# Altium project HARDWARE TASK.PrjPcb
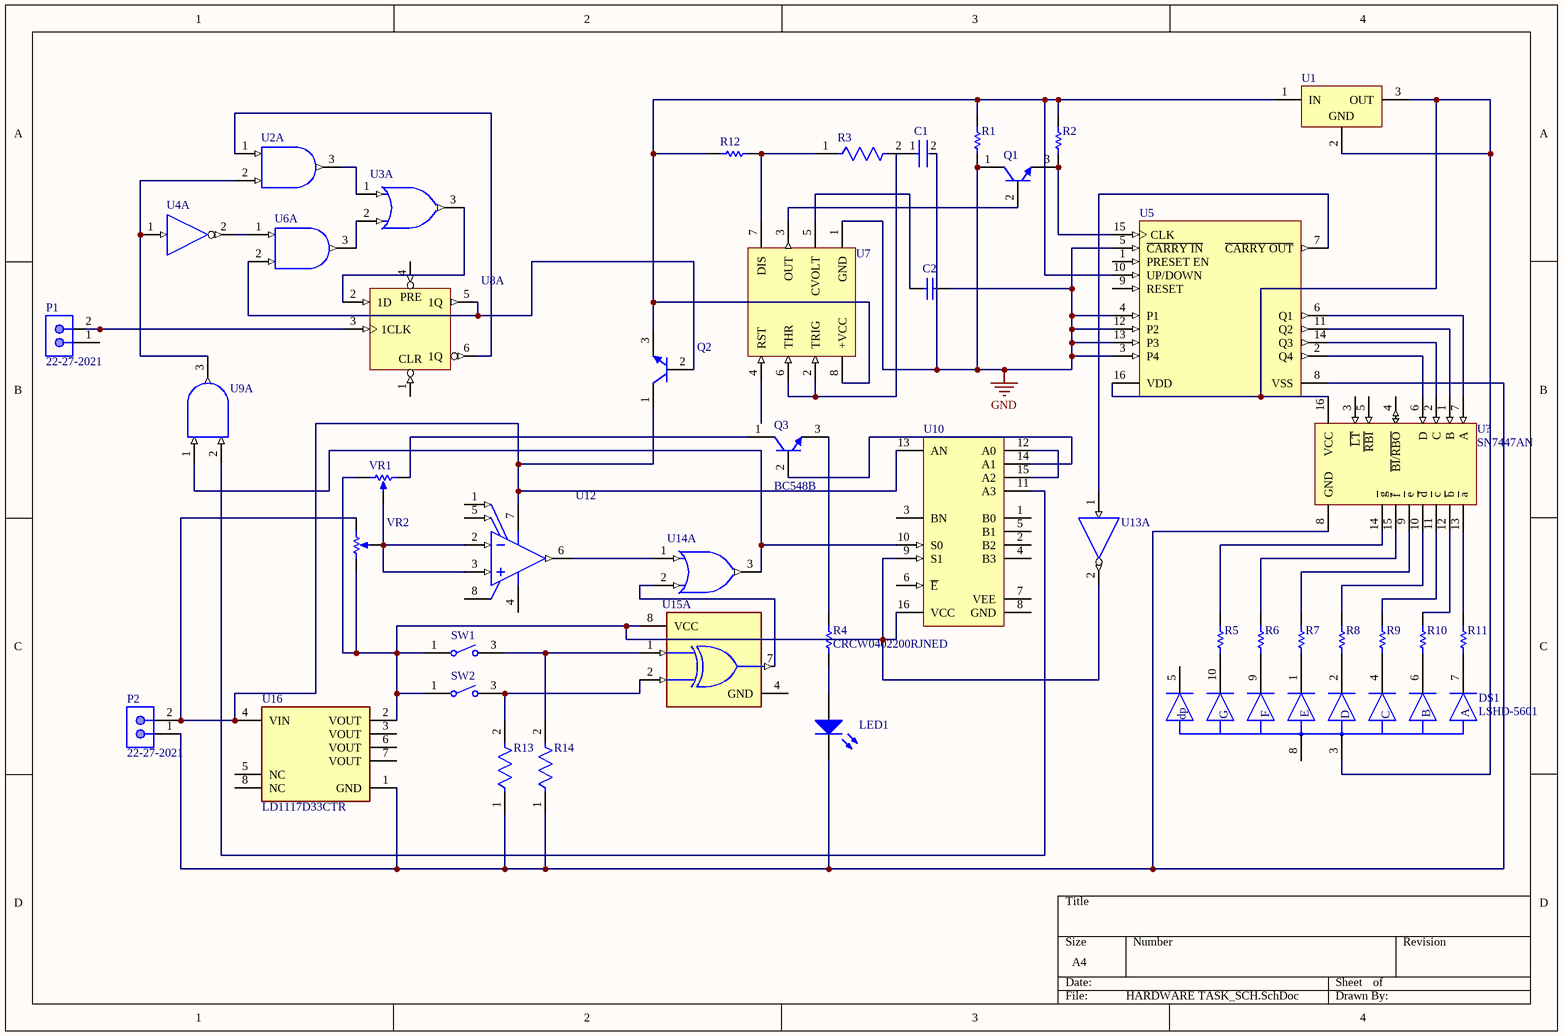
[diagram p0: HARDWARE TASK_SCH.SchDoc]
1 sheet, 43 parts. Net scope: global (net labels, ports and power ports of the same name join across sheets).
Board file: HARDWARE TASK_PCB.PcbDoc

## Sheet HARDWARE TASK_SCH.SchDoc
size A4; SheetNumber: 1; SheetTotal: 1

### Parts
C1  GRM21BR61E106KA73L  [CAP 10UF]  (value not drawn)
C2  GRM188R71H103KA01D  [CAP 10NF]  (value not drawn)
DS1  LSHD-5601  [7SEG]
LED1  151051BS04000  [BLUE LED]  (value not drawn)
P1  22-27-2021  [PIN]
P2  22-27-2021  [PIN]
Q1  BC548B  [NPN TRANS]  (value not drawn)
Q2  BC548B  [NPN TRANS]  (value not drawn)
Q3  BC548B  [NPN TRANS]
R1  CRCW0402200RJNED  [200 OHM RES]  (value not drawn)
R2  CRCW0402200RJNED  [200 OHM RES]  (value not drawn)
R3  RN732BTTD6002B25  [60KOHM RES]  (value not drawn)
R4  CRCW0402200RJNED  [200 OHM RES]
R5  CRCW0402200RJNED  [200 OHM RES]  (value not drawn)
R6  CRCW0402200RJNED  [200 OHM RES]  (value not drawn)
R7  CRCW0402200RJNED  [200 OHM RES]  (value not drawn)
R8  CRCW0402200RJNED  [200 OHM RES]  (value not drawn)
R9  CRCW0402200RJNED  [200 OHM RES]  (value not drawn)
R10  CRCW0402200RJNED  [200 OHM RES]  (value not drawn)
R11  CRCW0402200RJNED  [200 OHM RES]  (value not drawn)
R12  CRCW121010K0FKEAHP  [10KOHM RES]  (value not drawn)
R13  CRCW0603330RFKEA  [330OHM RES]  (value not drawn)
R14  CRCW0603330RFKEA  [330OHM RES]  (value not drawn)
SW1  TS02CBE  [SPST SWITCH]  (value not drawn)
SW2  TS02CBE  [SPST SWITCH]  (value not drawn)
U1  LM340T-5.0  [5V REG]  (value not drawn)
U2  SN74LS08DBR  [AND]  (value not drawn)  (part A of 5)
U3  SN74LS32NSR  [OR]  (value not drawn)  (part A of 5)
U4  SN74LS04DR  [INVERTER NOT]  (value not drawn)  (part A of 7)
U5  CD4510BNSR  [BCD COUNTER]  (value not drawn)
U6  SN74LS08DBR  [AND]  (value not drawn)  (part A of 5)
U7  LM555CMM/NOPB  [TIMER_1]  (value not drawn)
U8  SN74LS74AD  [D FLIP FLOP]  (value not drawn)  (part A of 3)
U9  SN74LS08DBR  [AND]  (value not drawn)  (part A of 5)
U10  CD74HC4052E  [DEMUX]  (value not drawn)
U12  UA741CD  [OP AMP]  (value not drawn)
U13  SN74LS04DR  [INVERTER NOT]  (value not drawn)  (part A of 7)
U14  SN74LS32NSR  [OR]  (value not drawn)  (part A of 5)
U15  SN74LVC2G86DCTR  [XOR - duplicate]  (value not drawn)  (part A of 2)
U16  LD1117D33CTR  [3.3V REG]
U?  SN7447AN  [7SEG DECODER]
VR1  3852A-282-103AL  [POT]  (value not drawn)
VR2  3852A-282-103AL  [POT]  (value not drawn)

### Nets
GND: C1.2 C2.2 Q1.1(C) R1.1 U5.3(P4) U5.4(P1) U5.5(~{CARRY_IN}) U5.12(P2) U5.13(P3) U7.1(GND)
NetC1_1: C1.1 R3.2
NetC2_1: C2.1 U7.5(CVOLT)
NetDS1_1: DS1.1(CATHODE_E) R7.1
NetDS1_2: DS1.2(CATHODE_D) R8.1
NetDS1_3: DS1.3(COMMON_ANODE) U1.2(GND) U1.3(OUT) U5.16(VDD) U?.16(VCC)
NetDS1_4: DS1.4(CATHODE_C) R9.1
NetDS1_6: DS1.6(CATHODE_B) R10.1
NetDS1_7: DS1.7(CATHODE_A) R11.1
NetDS1_9: DS1.9(CATHODE_F) R6.1
NetDS1_10: DS1.10(CATHODE_G) R5.1
NetLED1_1: LED1.1(K) P2.1 R13.1 R14.1 U5.8(VSS) U16.1(GND) U?.8(GND)
NetLED1_2: LED1.2(A) R4.1
NetP1_2: P1.2 U8.3(1CLK)
NetP2_2: P2.2 Q2.1(C) U10.13(AN) U12.7(VCC+) U16.4(VIN) VR2.3(CW)
NetQ1_2: Q1.2(B) U7.3(OUT)
NetQ1_3: Q1.3(E) R2.1 U5.15(CLK)
NetQ2_2: Q2.2(B) U6.2(1B) U8.5(1Q)
NetQ2_3: Q2.3(E) R1.2 R2.2 R12.1 U1.1(IN) U5.10(UP/DOWN) U7.8(+VCC)
NetQ3_1: Q3.1(C) VR1.3(CW)
NetQ3_2: Q3.2(B) U10.14(A1)
NetQ3_3: Q3.3(E) R4.2
NetR3_1: R3.1 R12.2 U7.7(DIS)
NetR5_2: R5.2 U?.14(~{g})
NetR6_2: R6.2 U?.15(~{f})
NetR7_2: R7.2 U?.9(~{e})
NetR8_2: R8.2 U?.10(~{d})
NetR9_2: R9.2 U?.11(~{c})
NetR10_2: R10.2 U?.12(~{b})
NetR11_2: R11.2 U?.13(~{a})
NetR13_2: R13.2 SW2.3 U15.2(1B)
NetR14_2: R14.2 SW1.3 U15.1(1A)
NetSW1_1: SW1.1 SW2.1 U10.9(S1) U10.16(VCC) U13.2(~{1Y}) U15.8(VCC) U16.2(VOUT) VR1.1(CCW) VR2.1(CCW)
NetU2_1: U2.1(1A) U8.6(1Q)
NetU2_2: U2.2(1B) U4.1(1A) U9.3(1Y)
NetU2_3: U2.3(1Y) U3.1(1A)
NetU3_2: U3.2(1B) U6.3(1Y)
NetU3_3: U3.3(1Y) U8.2(1D)
NetU4_2: U4.2(~{1Y}) U6.1(1A)
NetU5_2: U5.2(Q4) U?.6(D)
NetU5_6: U5.6(Q1) U?.7(A)
NetU5_7: U5.7(~{CARRY_OUT}) U13.1(1A)
NetU5_11: U5.11(Q2) U?.1(B)
NetU5_14: U5.14(Q3) U?.2(C)
NetU7_2: U7.2(TRIG) U7.6(THR)
NetU9_1: U9.1(1A) U10.10(S0) U14.3(1Y)
NetU9_2: U9.2(1B) U10.11(A3)
NetU10_12: U10.12(A0) U10.15(A2)
NetU12_2: U12.2(IN-) U12.3(IN+) VR1.2(S) VR2.2(S)
NetU12_6: U12.6(OUT) U14.1(1A)
NetU14_2: U14.2(1B) U15.7(1Y)

Not connected (* = marked no-connect by the designer): DS1 5(CATHODE_DP) 8(COMMON_ANODE); P1 1; U5 1(PRESET_EN) 9(RESET); U7 4(RST); U8 1(1~{CLR}) 4(1~{PRE}); U10 1(B0) 2(B2) 3(BN) 4(B3) 5(B1) 6(~{E}) 7(VEE) 8(GND); U12 1(OFFSET_N1) 4(VCC-) 5(OFFSET_N2) 8(NC); U15 4(GND); U16 3(VOUT) 5(NC) 6(VOUT) 7(VOUT) 8(NC); U? 3(~{LT}) 4(~{BI}/~{RBO}) 5(~{RBI})

### Notes on the sheet
- (in symbol 7SEG) dp; G; F; E; D; C; B; A
- (in symbol D FLIP FLOP, part A) PRE; CLR

### Library data of the parts
C1 = CAP 10UF: Chip Multilayer Ceramic Capacitors for General Purpose, 0805, 10uF, X5R, 15%, 10%, 25V; Length: 2mm; Depth: 1.25mm; Termination: SMD/SMT; Voltage: 25V; Height: 1.25mm; Material: Ceramic; Thickness: 0.053inch; Radiation Hardening: No; Min Operating Temperature: -55°C; Width: 0.049inch; Package Quantity: 1; Mount: Surface Mount; Dielectric: X5R; Packaging: Tape and Reel; Capacitance: 10uF; Voltage Rating (DC): 25V; Lead Free: Lead Free; Max Operating Temperature: 85°C; Case Code (Imperial): 0805; Case/Package: 0805; Tolerance: 10%; Voltage Rating: 25V; Case Code (Metric): 2012
C2 = CAP 10NF: Chip Capacitor, 10 nF, +/- 10%, 50 V, -55 to 125 degC, 0603 (1608 Metric), RoHS, Tape and Reel; Manufacturer: Murata; Insulation Resistance: 10GR; Dielectric: X7R; Voltage Rating: 50V; Capacitance: 10nF; Material: Ceramic; Package Quantity: 1; Lead Free: LeadFree; Case/Package: 0603; Termination: SMD/SMT; REACH SVHC: Unknown; Manufacturer URL: http://www.murata.com/; Datasheet URL: http://search.murata.co.jp/Ceramy/image/img/A01X/G101/ENG/GRM188R71H103KA01-01.pdf; Mount: SurfaceMount; Datasheet Version: 42401.0; Number of Pins: 2; Length: 1.6mm; Voltage: 50V; Depth: 0.8mm; Tolerance: 10%; Min Operating Temperature: -55degC; Voltage Rating (DC): 50V; Max Operating Temperature: 125degC; Package Description: 2-Pin Surface Mount Device, Body 1.6 x 0.8 mm; RoHSCompliant: True; Case Code (Imperial): 0603; Width: 0.031inch; Case Code (Metric): 1608; Height: 0.8mm; Package Reference: 0603; Packaging: TapeandReel; Thickness: 0.035inch; Dielectric Material: Ceramic
DS1 = 7SEG: LED 7-SEG .56" GREEN 565NM CA; Manufacturer: Lite-On; Wavelength: 569nm; Luminous Intensity: 2.4mcd; Forward Current: 20mA; Forward Voltage: 2.1V; Element Config: Common Anode; Reverse Voltage: 5V; Device Class L1: Optoelectronics; ComponentLink2URL: https://media.digikey.com/pdf/Data%20Sheets/Lite-On%20PDFs/LSHD-5601.pdf; Temperature Range High: +105°C; ComponentLink2Description: Datasheet; Automotive: No; Temperature: -35°C to +105°C; Mouser Description: LED Displays & Accessories Green, Low Current 0.56, CARHD; Package: LSHD-5601; Device Class L3: LED Displays; Height: 8.25mm; Digikey Description: LED 7-SEG .56" GREEN 565NM CA; Category: Disp; Display Type: LED; Octopart: https://octopart.com/lshd-5601-lite-on-548440; Lead Free: Yes; Temperature Range Low: -35°C; RoHS: TRUE; Test Current: 20mA; Manufacturer Part Number: LSHD-5601; Device Class L2: Displays
LED1 = BLUE LED: THT LED round mono-color color lens, WL-TMRW, Blue; Manufacturer: Wuerth Elektronik; PackageReference: Type 5mm; ComponentLink2Description: Datasheet; ComponentLink1Description: Manufacturer URL; Emitting color: Blue; ComponentLink1URL: http://www.we-online.com; PartNumber: 151051BS04000; ComponentLink2URL: http://katalog.we-online.de/pbs/datasheet/7448042001.pdfhttp://katalog.we-online.de/pbs/datasheet/7448042001.pdfhttp://katalog.we-online.de/pbs/datasheet/7448042001.pdfhttp://katalog.we-online.de/pbs/datasheet/151051BS04000.pdf
P1 P2 = PIN: Male Header, Pitch 2.54 mm, 1 x 2 Position, Height 11.7 mm, Tail Length 3.56 mm, 0 to 75 degC, RoHS, Bulk; Manufacturer: Molex; PartNumber: 0022272021; Current rating: 4A; Package Version: Rev. BC, 02/2012; Voltage rating: 250V; No. of Positions: 2; Pitch: 2.54mm; No. of Rows: 1; Orientation: Vertical; Operating temperature: 0°Cto+75°C; Manufacturer URL: http://www.molex.com/; Mounting Technology: ThroughHole; Housing material: Nylon(UL94V-0); Package Description: 2-Leads Header, Body 5.08 x 5.8 mm, Pitch 2.54 mm; Voltage - Max: 250V; Datasheet URL: http://www.molex.com/pdm_docs/sd/022272021_sd.pdf; Package Reference: 22-27-2021; Contact material: Tinplatedbrass; Current - Max: 4A; Datasheet Version: Rev. F, 06/2009
Q1-Q3 = NPN TRANSISTOR: Amplifier Transistor, NPN Silicon, 3-Pin TO-92, Bulk Box; Manufacturer: On Semiconductor; IC Continuous (A): 0.1; fT Min (MHz): 150; Mounting Technology: Through Hole; ComponentLink3Description: Package Specification; Polarity: NPN; ComponentLink3URL: http://www.onsemi.cn/pub_link/Collateral/2N6426-D.PDF; PartNumber: BC548B; ComponentLink2Description: Datasheet; ComponentLink1Description: Manufacturer URL; ComponentLink2URL: http://www.onsemi.com/pub_link/Collateral/BC546-D.PDF; PackageReference: TO-92-3-29-11_AM_SL; DatasheetVersion: Rev. 7; PackageDescription: 3-Pin Transistor Outline, Body 4.825 x 3.685 mm, Pitch 1.27 mm; PackageVersion: Rev. AM; Packing: Bulk Box; RoHS: FALSE; ComponentLink1URL: http://www.onsemi.com/
R1 R2 R4-R11 = 200OHM RES: Manufacturer: Vishay Dale; Part Number: CRCW0402200RJNED
R3 = 60KOHM RES: 60kΩ ±0.1% 0.125W, 1/8W Chip Resistor 1206 (3216 Metric) Moisture Resistant Thin Film; Resistance: 60kR; Voltage Rating: 150V; Power Rating: 125mW; Temperature Coefficient: 25ppm/°C; Length: 3.2mm; Min Operating Temperature: -55°C; Width: 1.6mm; Termination: SMD/SMT; Weight: 0.000571oz; Max Operating Temperature: 125°C; Tolerance: 0.1%; Composition: Thin Film; Height: 0.6mm; Packaging: Tape and Reel; Case Code (Metric): 3216; Case Code (Imperial): 1206; Case/Package: 1206
R12 = 10KOHM RES: Manufacturer: Vishay Dale; Part Number: CRCW121010K0FKEAHP
R13 R14 = 33OHM RES: RES Thick Film, 330Ω, 1%, 0.1W, 100ppm/°C, 0603; Voltage Rating: 75V; Max Power Dissipation: 100mW; Resistance: 330R; Depth: 0.85mm; Contact Plating: Tin; Package Quantity: 10; Termination: SMD/SMT; Tolerance: 1%; Height: 0.45mm; Number of Terminations: 2; Radiation Hardening: No; Features: Automotive AEC-Q200; Case/Package: 0603; Mount: Surface Mount; Case Code (Metric): 1608; Lead Free: Lead Free; Temperature Coefficient: 100ppm/°C; Weight: 7.1E-05oz; Military Standard: Not; Packaging: Tape and Reel; Max Operating Temperature: 155°C; Voltage Rating (DC): 75V; Length: 1.55mm; Min Operating Temperature: -55°C; Composition: Thick Film; Case Code (Imperial): 0603; Width: 0.033inch; Power Rating: 100mW
SW1 SW2 = SPST SWITCH: Tiny Slide Switch, SPST, 20 V, -30 to 85 degC, 2-Pin THD, RoHS, Bulk; Manufacturer: C&K Components; Product Height (mm): 12.91mm; Actuator Style: TopSlide; Product Length (mm): 10.16mm; Switch Configuration: OFFNoneON; AC Voltage Rating (Max): 20V; Product Depth (mm): 5.08mm; Actuator Material: Nylon; Mounting Technology: ThroughHole; Manufacturer URL: http://www.ckswitches.com/; Type: Tiny; Pole Throw Configuration: SPST; Terminal Type: PCPins; Package Reference: TS02CBE; Package Description: 2-Pin Through Hole Device, Body 10.16 x 5.08 mm; Datasheet Version: 02/2016; Datasheet URL: http://www.ck-components.com/media/1426/ts_12feb16.pdf; Contact Material: CopperAlloy; Housing Material: N/A/StainlessSteel; Operating Temp Range: -30Cto85C; Contact Plating: Gold/Nickel; DC Voltage Rating (Max): 20V; Mounting Style: ThroughHole
U1 = 5V REG: Series 3-Terminal Positive Regulators, 3-pin TO-220; Manufacturer: Texas Instruments; PowerWise: N; CompType: LDO IC; PackageTopMarking: NSUZXYTTE#*LM340T5*7805 P+; RoHS: N; ComponentLink1URL: http://www.ti.com/general/docs/lit/getliterature.tsp?genericPartNumber=LM340-N&fileType=pdf; PinCount: 3; PackageReference: NDE0003A; ComponentLink1Description: Datasheet URL; PackageDescription: TO-220, Molded, 3 Lead, Straight
U2 U6 U9 = AND: Quadruple 2-Input Positive-AND Gates, DB0014A, LARGE T&R; Manufacturer: Texas Instruments; F @ Nom Voltage(Max)(Mhz): 35; Output Type: TTL; VCC(Min)(V): 4.75; Output Drive (IOL/IOH)(Max)(mA): -0.8/16; Voltage(Nom)(V): 5; VCC(Max)(V): 5.25; Schmitt Trigger: No; Technology Family: LS; ICC @ Nom Voltage(Max)(mA): 0.021; tpd @ Nom Voltage(Max)(ns): 25; Rating: Catalog; Bits(#): 4; Generic Part Number: SN74LS08; Operating Temperature Range(C): 0 to 70; DatasheetVersion: SDLS033; Input Type: TTL; PackageReference: DB0014A
U3 U14 = OR: Quad 2-input positive-OR gates, NS0014A, LARGE T&R; Manufacturer: Texas Instruments; VCC(Max)(V): 5.25; VCC(Min)(V): 4.75; Input Type: TTL; Output Drive (IOL/IOH)(Max)(mA): 0.8/-16; Bits(#): 4; Rating: Catalog; ICC @ Nom Voltage(Max)(mA): 0.038; F @ Nom Voltage(Max)(Mhz): 35; Voltage(Nom)(V): 5; tpd @ Nom Voltage(Max)(ns): 22; PackageReference: NS0014A; Operating Temperature Range(C): 0 to 70; PackageVersion: http://www.ti.com/lit/ml/msop002a/msop002a.pdf; Output Type: TTL; DatasheetVersion: SDLS100; Generic Part Number: SN74LS32
U4 U13 = NOT: Hex inverters, D0014A, LARGE T&R; Manufacturer: Texas Instruments; Output Drive (IOL/IOH)(Max)(mA): -0.4/8; F @ Nom Voltage(Max)(Mhz): 35; Rating: Catalog; Voltage(Nom)(V): 5; Input Type: TTL; Bits(#): 6; tpd @ Nom Voltage(Max)(ns): 22; Schmitt Trigger: No; ICC @ Nom Voltage(Max)(mA): 0.033; Technology Family: LS; VCC(Min)(V): 4.75; Output Type: CMOS; VCC(Max)(V): 5.25; DatasheetVersion: SDLS029C; Code_JEDEC: MS-012; Operating Temperature Range(C): 0 to 70; PackageReference: D0014A; Generic Part Number: SN74LS04
U5 = BCD COUNTER: CMOS Presettable BCD Up/Down Counter, NS0016A, LARGE T&R; Manufacturer: Texas Instruments; Bits(#): 4; VCC(Min)(V): 3; Voltage(Nom)(V): 5,10,15; Schmitt Trigger: No; Output Drive (IOL/IOH)(Max)(mA): 1.5/-1.5; Rating: Catalog; Inputs: 1; VCC(Max)(V): 18; Technology Family: CD4000; F @ Nom Voltage(Max)(Mhz): 8; ICC @ Nom Voltage(Max)(mA): 0.03; tpd @ Nom Voltage(Max)(ns): 200; PackageReference: NS0016A; DatasheetVersion: SCHS071B; Generic Part Number: CD4510B; Operating Temperature Range(C): -55 to 125; Output Type: CMOS; Input Type: CMOS; Type: Other; Function: Counter
U7 = TIMER_1: Timer, 8-pin Mini SOIC, Pb-Free; Manufacturer: Texas Instruments; CompType: Analog IC; PowerWise: N; PackageTopMarking: ZXTT*Z55; ComponentLink1URL: http://www.ti.com/general/docs/lit/getliterature.tsp?genericPartNumber=LM555&fileType=pdf; PackageDescription: MINI SOIC, .118 x .118 x .034in, 8 Lead, .0256in Pitch; PinCount: 8; RoHS: Y; ComponentLink1Description: Datasheet URL; PackageReference: DGK0008A; Code_JEDEC: MO-187-AA
U8 = D FLIP FLOP: Dual D-type pos.-edge-triggered flip-flops with preset and clear, D0014A, TUBE; Manufacturer: Texas Instruments; Output Drive (IOL/IOH)(Max)(mA): 8/-0.4; Voltage(Nom)(V): 5; Output: 3S; ICC @ Nom Voltage(Max)(mA): 8; tpd @ Nom Voltage(Max)(ns): 40; Rating: Catalog; VCC(Min)(V): 4.75; Output Type: TTL; Technology Family: LS; VCC(Max)(V): 5.25; Bits(#): 2; Output Logic: Inverted,Non-inverted; 3-State Output: No; F @ Nom Voltage(Max)(Mhz): 35; DatasheetVersion: SDLS119; Generic Part Number: SN74LS74A; Operating Temperature Range(C): 0 to 70; Input Type: TTL; PackageReference: D0014A; Code_JEDEC: MS-012; Schmitt Trigger: No
U10 = DEMUX: High Speed CMOS Differential 4-Channel Analog Multiplexer/Demultiplexer, N0016A, TUBE; Manufacturer: Texas Instruments; Ron(Max)(Ohms): 130; Ron(Typ)(Ohms): 45; Bandwidth(Max)(MHz): 185; VCC(Min)(V): 2; Configuration: 2 X 1：4 MUX; VCC(Max)(V): 6; Rating: Catalog; Crosstalk: Yes; Operating Temperature Range(C): -55 to 125; Code_JEDEC: MS-001; Output Type: CMOS; DatasheetVersion: SCHS122J; PackageVersion: http://www.ti.com/lit/ml/mpdi002c/mpdi002c.pdf; Generic Part Number: CD74HC4052; PackageReference: N0016A
U12 = OP AMP: General-Purpose Operational Amplifier, 7 to 36 V, 0 to 70 degC, 8-pin SOIC (D8), Green (RoHS & no Sb/Br); Manufacturer: Texas Instruments; Total Supply Voltage(Max)(+5V is 5, +/-5V is 10): 36; Number of Channels: 1; Total Supply Voltage(Min)(+5V is 5, +/-5V is 10): 7; Iq per channel(Max)(mA): 2.8; Slew Rate(Typ)(V/us): 0.5; Vio (25C)(Max)(mV): 6; Sub Family: General Purpose Amplifier, High Supply Voltage Amplifier (>=30V); CMRR(Min)(dB): 70; IIB(Max)(pA): 800000; Code_JEDEC: MS-012; Eco-Plan: Green (RoHS & no Sb/Br); PackageReference: D0008A; ComponentLink1Description: Manufacturer URL; PackageVersion: 4040047-3/M, 06/2011; ComponentLink3URL: http://www.ti.com/litv/pdf/msoi002j; PartNumber: UA741CD; ComponentLink1URL: http://www.ti.com/; DatasheetVersion: SLOS094B; GBW(Typ)(MHz): 1; ComponentLink2Description: Datasheet; Mounting Technology: Surface Mount; ComponentLink3Description: Package Specification; PackageDescription: 8-Pin Plastic Small Outline, Body 4.9 x 3.9 mm, Pitch 1.27 mm; ComponentLink2URL: http://www.ti.com/lit/ds/symlink/ua741.pdf
U15 = XOR_1: IC GATE XOR 2CH 2-INP SM8; Number of Bits: 2; High Level Output Current: -32mA; Logic Function: XOR GATE; Turn-On Delay Time: 3.6ns; Low Level Output Current: 32mA; Number of Output Lines: 1; Quiescent Current: 10uA; Max Supply Voltage: 5.5V; Schmitt Trigger Input: No; Min Supply Voltage: 1.65V; Number of Inputs: 2; Min Operating Temperature: -40°C; Weight: 0.000825oz; Technology: CMOS; Contact Plating: Gold; Output Current: 32mA; Number of Circuits: 2; Packaging: Tape and Reel; Number of Pins: 8; Number of Elements: 2; Mount: Surface Mount; Package Quantity: 1; Series: 74LVC; Width: 2.8mm; Radiation Hardening: No; Max Operating Temperature: 125°C; REACH SVHC: No SVHC; Lead Free: Lead Free; Height: 1.29mm; RoHS Compliant: Yes; Propagation Delay: 3.6ns; Number of Gates: 2; Number of Outputs: 1; Case/Package: SSOP; Length: 2.95mm; Number of Input Lines: 2
U16 = 3.3V REG: IC REG LINEAR 3.3V 800MA 8SO; Accuracy: 1%; Max Input Voltage: 15V; Quiescent Current: 10mA; Number of Regulators: 1; Output Current: 1.3A; Max Power Dissipation: 12W; Output Type: Fixed; Input Bias Current: 5mA; Dropout Voltage: 1.1V; Polarity: Positive; Lead Free: Lead Free; Radiation Hardening: No; Number of Pins: 8; Output Voltage: 3.3V; Min Output Voltage: 3.3V; Width: 4mm; Packaging: Tape and Reel; Number of Outputs: 1; Max Operating Temperature: 125°C; Package Quantity: 1; Mount: Surface Mount; Min Operating Temperature: -40°C; Height: 1.65mm; Case/Package: SO; Power Dissipation: 12W; Max Output Current: 1.3A; Length: 5mm; Output Voltage Accuracy: 1%
U? = 7SEG DEC: BCD-to-7-Segment Decoder / Driver, 4.75 to 5.25 V, 0 to 70 degC, 16-pin DIP (N16), Pb-Free (RoHS); Manufacturer: Texas Instruments; SubFamily: Discrete Segment LED Driver; Vin(Max)(V): 5.25; Vin(Min)(V): 4.75; ComponentLink2Description: Datasheet; ComponentLink1URL: http://www.ti.com/; Mounting Technology: Through Hole; PackageReference: N0016A; ComponentLink1Description: Manufacturer URL; PartNumber: SN7447AN; PackageVersion: 4040049/E; ComponentLink3URL: http://www.ti.com/litv/pdf/mpdi002c; DatasheetVersion: SDLS111; ComponentLink2URL: http://www.ti.com/general/docs/lit/getliterature.tsp?genericPartNumber=SN7447A&fileType=pdf; Code_JEDEC: MS-001; ComponentLink3Description: Package Specification; Eco-Plan: Pb-Free (RoHS); PackageDescription: 16-Pin Plastic In-Line, Body 19.305 x 6.35 mm, Pitch 2.54 mm
VR1 VR2 = POT: Diameter Panel Control, 10 KOhm, +/- 10%, 2 W, -1 to 125 degC, 3-Pin THD, RoHS, Bulk; Manufacturer: Bourns; Temperature Coefficient: ±150ppm/degC; Number of Gangs: 1; Other Names: 3852A282103AL; Actuator Length: 0.875"(22.23mm); Resistive Material: Cermet; PCN Design/Specification: PBTResinJun/2011; Rotation: 280deg; PCN Other: MultipleChanges01/Dec/2012; Catalog Drawings: 3852SeriesSide1 / 3852SeriesSide2; Online Catalog: 3852and3856Series; Associated Product: 36-8560-ND / -KNOBINSTRUMW/DIALRND.9"DIA / 36-8555-ND / -KNOBINSTRUMSKIRTEDRND.7"DIA / 36-8556-ND / -KNOBINSTRUMSKIRTEDRND.9"DIA / 36-8565-ND / -KNOBINSTRUMDBLBARRND.7"DIA / 36-8566-ND / -KNOBINSTRUMDBLBARRND.9"DIA / 36-8568-ND / -KNOBINSTRUMSGLBARRND.7"DIA / 36-8569-ND / -KNOBINSTRUMSGLBARRND.9"DIA / 36-8559-ND / -KNOBINSTRUMW/DIALRND.7"DIA / 226-1006-ND / -KNOBBLKGLOSS.75"DIA.250"SHAFT / 226-1007-ND / -KNOBBLKGLOSS.925"DIA.250"SHAFT / 226-1011-ND / -KNOBBLKGLOS; Actuator Diameter: 0.250"(6.35mm); Built in Switch: None; Resistance (Ohms): 10k; Power (Watts): 2W; Actuator Type: Slotted; Standard Package: 45; Tolerance: ±10%; Taper: Linear; Series: 3852; Packaging: Bulk; Category: Potentiometers,VariableResistors; Bushing Thread: 3/8-32; Datasheet URL: https://datasheet.ciiva.com/11831/0900766b80f93b4b-11831016.pdf; Datasheet Version: Sep-14; Number of Turns: 1; Family: RotaryPotentiometers,Rheostats; Termination Style: SolderLug; RoHS Information: 3852A-LMaterialDeclaration; Mounting Type: PanelMount; Manufacturer URL: http://www.bourns.com/